# Altium schematic sheet USB_Serial_CH340G.SchDoc
size A; SheetNumber: 1; SheetTotal: 1
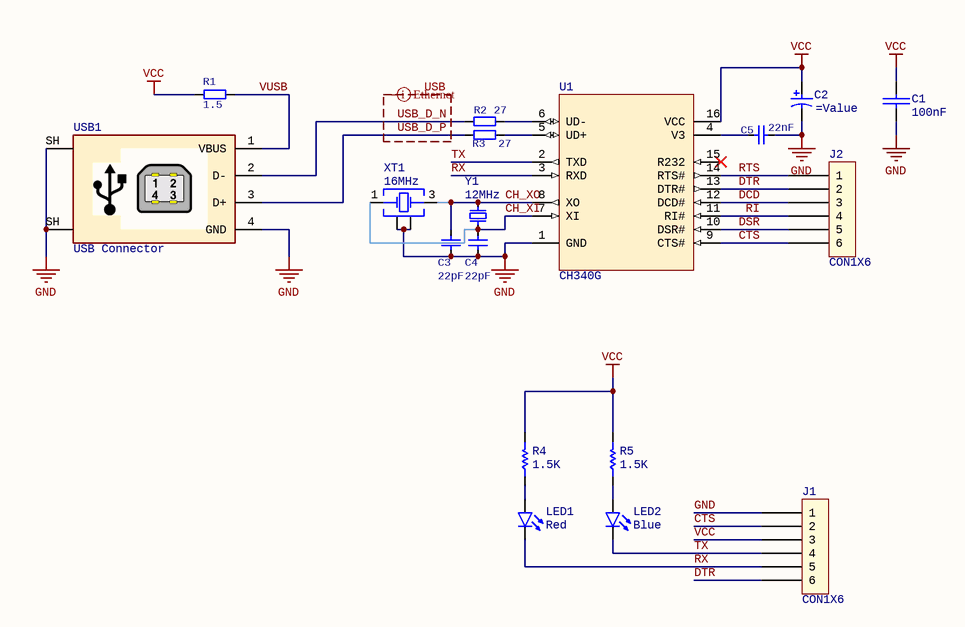
[diagram p0: USB_Serial_CH340G.SchDoc]

## Parts
C1  100nF  [CAP 1206 (3216X15L)]
C2  (no value)  [CAP SMD A (EIA1206)]
C3  22pF  [CAP 1206 (3216X15L)]
C4  22pF  [CAP 1206 (3216X15L)]
C5  22nF  [CAP 1206 (3216X15L)]
J1  CON1X6  [HP6]
J2  CON1X6  [HP6]
LED1  Color: Red  [LED 1206 SMD]  (hidden comment: RX)
LED2  Color: Blue  [LED 1206 SMD]  (hidden comment: TX)
R1  1.5  [RES 1206 (3216X08L)]
R2  27  [RES 1206 (3216X08L)]
R3  27  [RES 1206 (3216X08L)]
R4  1.5K  [RES 1206 (3216X08L)]
R5  1.5K  [RES 1206 (3216X08L)]
U1  CH340G  [SO-16_M]
USB1  USB Connector  [USB2.5-2H4E]
XT1  16MHz  [WE-XTAL_CFPX-180]
Y1  12MHz  [XT_Crystal_SMD]

## Nets
GND: C1.1(+) C2.2 C3.1(A) C4.2(B) C5.2(B) J1.1 U1.1(GND) USB1.4(GND) USB1.SH XT1.2(GND) XT1.4(GND)
VCC: C1.2(-) C2.1 J1.3 R1.1(A) R4.2 R5.2 U1.16(VCC)
CH_XI: C4.1(A) U1.7(XI) XT1.1(Crystal) Y1.1(A)
CH_XO: C3.2(B) U1.8(XO) XT1.3(Crystal) Y1.2(B)
CTS: J1.2 J2.6 U1.9(CTS#)
DCD: J2.3 U1.12(DCD#)
DSR: J2.5 U1.10(DSR#)
DTR: J1.6 J2.2 U1.13(DTR#)
RI: J2.4 U1.11(RI#)
RTS: J2.1 U1.14(RTS#)
RX: J1.5 LED1.2(K) U1.3(RXD)
TX: J1.4 LED2.2(K) U1.2(TXD)
USB_D_N: R2.2(B) USB1.2(D-)
USB_D_P: R3.2(B) USB1.3(D+)
VUSB: R1.2(B) USB1.1(VBUS)
NetC5_1: C5.1(A) U1.4(V3)
NetLED1_1: LED1.1(A) R4.1
NetLED2_1: LED2.1(A) R5.1
NetR2_1: R2.1(A) U1.6(UD-)
NetR3_1: R3.1(A) U1.5(UD+)

Not connected (* = marked no-connect by the designer): U1 15(R232)*

## Layout directives
differential pair; differential pair class USB; net class USB: USB_D_N, USB_D_P

## Library data of the parts
C1 = Cap-Bipolar: Bipolar Capacitor; Voltage: 100V; Value: 100nF
C2 = CMP-1664-00002-2: Tantalum Capacitor, 1uF, 50V, 2-Leads, SMD 1206; Value: 1uF-35V; Voltage: 35V; PackageDescription: 2-Pin Surface Mount Device; Case/Package: 1206; Mounting Technology: Surface Mount; Capacitance: 1uF
C3-C5 = C_NP_ASA
J1 = HEADER-6POS: CH340 UART Pinout
J2 = HEADER-6POS: CH340 RS-232 Pinout
LED1 = LED: LED 1206 Red; Size: SMD 1206
LED2 = LED: LED 1206 Blue; Size: SMD 1206
R1-R3 = R_ASA
R4 R5 = Resistor: Tolerance: 5%; Power: 1/8 W; Value: 1.5K
U1 = CH340G: USB to UART Interface SOIC-16 SMD
USB1 = USB-B: USB Connector Type-B
XT1 = 830051068: XTAL Quartz Crystal, SMT, CFPX-180, 25MHz, +/-10ppm; Manufacturer 1: Wurth Elektronik; Load Capacitance: 9pF; ComponentLink1Description: Manufacturer; ComponentLink1URL: http://www.we-online.de; ComponentLink2Description: Datasheet; ComponentLink2URL: https://katalog.we-online.com/pbs/datasheet/830051068.pdf; Operating Temperature: -20 to +70degC; Packaging: Tape and Reel; Manufacturer 1 PartNo: 830051068; Published Date: July 2020; Size: CFPX-180; Frequency Stability: +/-10ppm; Frequency: 25MHz; Frequency Tolerance: +/-10ppm; Mounting Technology: SMT
Y1 = XT_ASA: Crystal SMD 2-Leads